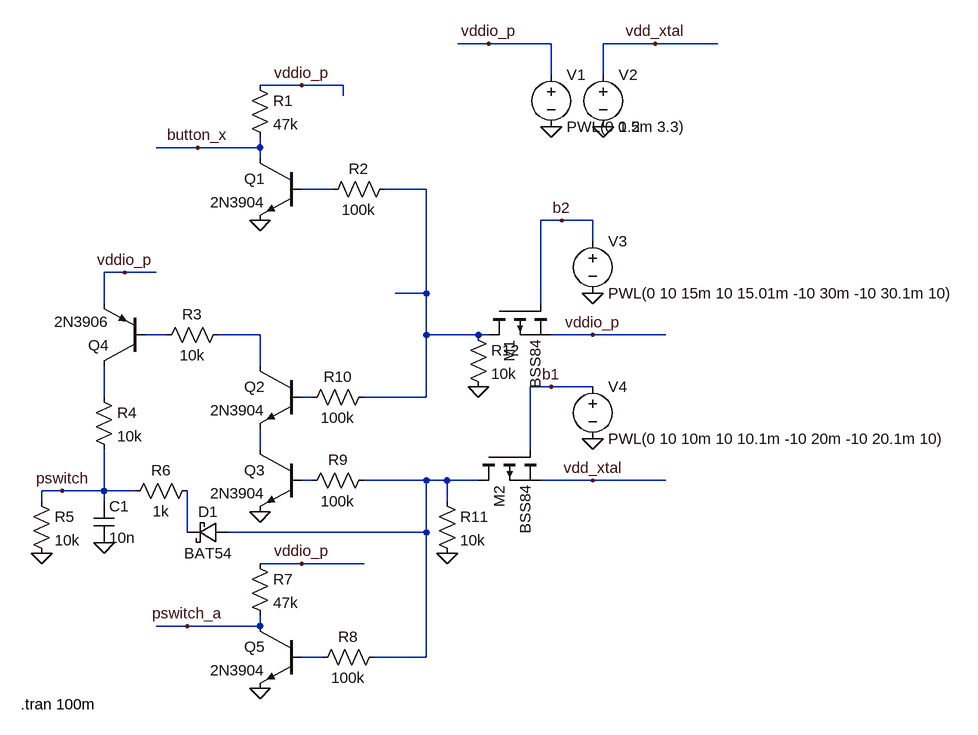
[diagram p0: schematic power switch and recovery mode pswitch.asc]
power switch and recovery mode pswitch.asc, the LTspice schematic file:
Version 4
SHEET 1 1348 984
WIRE 560 -48 512 -48
WIRE 656 -48 560 -48
WIRE 816 -48 736 -48
WIRE 912 -48 816 -48
WIRE 656 0 656 -48
WIRE 736 0 736 -48
WIRE 272 16 208 16
WIRE 336 16 272 16
WIRE 336 32 336 16
WIRE 112 112 48 112
WIRE 208 112 208 96
WIRE 208 112 112 112
WIRE 208 128 208 112
WIRE 320 176 272 176
WIRE 464 176 400 176
WIRE 672 224 640 224
WIRE 720 224 672 224
WIRE 720 256 720 224
WIRE 0 304 -32 304
WIRE 48 304 0 304
WIRE 464 336 464 176
WIRE 464 336 416 336
WIRE -32 352 -32 304
WIRE 640 352 640 224
WIRE 64 400 32 400
WIRE 208 400 144 400
WIRE 464 400 464 336
WIRE 544 400 464 400
WIRE 560 400 544 400
WIRE 720 400 656 400
WIRE 832 400 720 400
WIRE 208 448 208 400
WIRE 656 480 624 480
WIRE 720 480 656 480
WIRE -32 496 -32 448
WIRE 288 496 272 496
WIRE 464 496 464 400
WIRE 464 496 368 496
WIRE 208 576 208 544
WIRE 624 576 624 480
WIRE 288 624 272 624
WIRE 464 624 368 624
WIRE 496 624 464 624
WIRE 544 624 496 624
WIRE 720 624 640 624
WIRE 832 624 720 624
WIRE -96 640 -128 640
WIRE -32 640 -32 576
WIRE -32 640 -96 640
WIRE 16 640 -32 640
WIRE -128 656 -128 640
WIRE -32 656 -32 640
WIRE 496 656 496 624
WIRE 96 704 96 640
WIRE 464 704 464 624
WIRE 464 704 160 704
WIRE 272 752 208 752
WIRE 368 752 272 752
WIRE 96 848 48 848
WIRE 208 848 208 832
WIRE 208 848 96 848
WIRE 304 896 272 896
WIRE 464 896 464 704
WIRE 464 896 384 896
FLAG 208 672 0
FLAG 208 944 0
FLAG -32 720 0
FLAG -128 736 0
FLAG 208 224 0
FLAG -96 640 pswitch
FLAG 272 752 vddio_p
FLAG 96 848 pswitch_a
FLAG 272 16 vddio_p
FLAG 112 112 button_x
FLAG 0 304 vddio_p
FLAG 720 624 vdd_xtal
FLAG 720 400 vddio_p
FLAG 656 80 0
FLAG 736 80 0
FLAG 560 -48 vddio_p
FLAG 816 -48 vdd_xtal
FLAG 720 336 0
FLAG 720 560 0
FLAG 656 480 b1
FLAG 672 224 b2
FLAG 496 736 0
FLAG 544 480 0
SYMBOL res 192 0 R0
SYMATTR InstName R1
SYMATTR Value 47k
SYMBOL npn 272 128 M0
SYMATTR InstName Q1
SYMATTR Value 2N3904
SYMBOL res 416 160 R90
WINDOW 0 0 56 VBottom 0
WINDOW 3 32 56 VTop 0
SYMATTR InstName R2
SYMATTR Value 100k
SYMBOL npn 272 448 M0
SYMATTR InstName Q2
SYMATTR Value 2N3904
SYMBOL npn 272 576 M0
SYMATTR InstName Q3
SYMATTR Value 2N3904
SYMBOL pnp 32 448 R180
SYMATTR InstName Q4
SYMATTR Value 2N3906
SYMBOL res 160 384 R90
WINDOW 0 0 56 VBottom 0
WINDOW 3 32 56 VTop 0
SYMATTR InstName R3
SYMATTR Value 10k
SYMBOL res -48 480 R0
SYMATTR InstName R4
SYMATTR Value 10k
SYMBOL cap -48 656 R0
SYMATTR InstName C1
SYMATTR Value 10n
SYMBOL res -144 640 R0
SYMATTR InstName R5
SYMATTR Value 10k
SYMBOL res 112 624 R90
WINDOW 0 0 56 VBottom 0
WINDOW 3 32 56 VTop 0
SYMATTR InstName R6
SYMATTR Value 1k
SYMBOL npn 272 848 M0
SYMATTR InstName Q5
SYMATTR Value 2N3904
SYMBOL res 192 736 R0
SYMATTR InstName R7
SYMATTR Value 47k
SYMBOL res 400 880 R90
WINDOW 0 0 56 VBottom 0
WINDOW 3 32 56 VTop 0
SYMATTR InstName R8
SYMATTR Value 100k
SYMBOL res 384 608 R90
WINDOW 0 0 56 VBottom 0
WINDOW 3 32 56 VTop 0
SYMATTR InstName R9
SYMATTR Value 100k
SYMBOL res 384 480 R90
WINDOW 0 0 56 VBottom 0
WINDOW 3 32 56 VTop 0
SYMATTR InstName R10
SYMATTR Value 100k
SYMBOL pmos 560 352 M90
SYMATTR InstName M1
SYMATTR Value BSS84
SYMBOL pmos 544 576 M90
SYMATTR InstName M2
SYMATTR Value BSS84
SYMBOL voltage 656 -16 R0
WINDOW 123 0 0 Left 0
WINDOW 39 0 0 Left 0
SYMATTR InstName V1
SYMATTR Value PWL(0 0 5m 3.3)
SYMBOL voltage 736 -16 R0
WINDOW 123 0 0 Left 0
WINDOW 39 0 0 Left 0
SYMATTR InstName V2
SYMATTR Value 1.2
SYMBOL voltage 720 240 R0
WINDOW 123 0 0 Left 0
WINDOW 39 0 0 Left 0
SYMATTR InstName V3
SYMATTR Value PWL(0 10 15m 10 15.01m -10 30m -10 30.1m 10)
SYMBOL voltage 720 464 R0
WINDOW 123 0 0 Left 0
WINDOW 39 0 0 Left 0
SYMATTR InstName V4
SYMATTR Value PWL(0 10 10m 10 10.1m -10 20m -10 20.1m 10)
SYMBOL schottky 160 688 R90
WINDOW 0 0 32 VBottom 0
WINDOW 3 32 32 VTop 0
SYMATTR InstName D1
SYMATTR Value BAT54
SYMATTR Description Diode
SYMATTR Type diode
SYMBOL res 480 640 R0
SYMATTR InstName R11
SYMATTR Value 10k
SYMBOL res 528 384 R0
SYMATTR InstName R12
SYMATTR Value 10k
TEXT -160 968 Left 0 !.tran 100m

The netlist it stands for:
* power switch and recovery mode pswitch.asc
R1 vddio_p button_x 47k
Q1 button_x N001 0 0 2N3904
R2 N002 N001 100k
Q2 N004 N006 N007 0 2N3904
Q3 N007 N008 0 0 2N3904
Q4 N005 N003 vddio_p 0 2N3906
R3 N004 N003 10k
R4 N005 pswitch 10k
C1 pswitch 0 10n
R5 pswitch 0 10k
R6 N010 pswitch 1k
Q5 pswitch_a N011 0 0 2N3904
R7 vddio_p pswitch_a 47k
R8 N009 N011 100k
R9 N009 N008 100k
R10 N002 N006 100k
M1 N002 b2 vddio_p vddio_p BSS84
M2 N009 b1 vdd_xtal vdd_xtal BSS84
V1 vddio_p 0 PWL(0 0 5m 3.3)
V2 vdd_xtal 0 1.2
V3 b2 0 PWL(0 10 15m 10 15.01m -10 30m -10 30.1m 10)
V4 b1 0 PWL(0 10 10m 10 10.1m -10 20m -10 20.1m 10)
D1 N009 N010 BAT54
R11 N009 0 10k
R12 N002 0 10k
.model D D
.lib standard.dio
.model NPN NPN
.model PNP PNP
.lib standard.bjt
.model NMOS NMOS
.model PMOS PMOS
.lib standard.mos
.tran 100m
.backanno
.end

* Results of the author's LTspice run, read from the files saved beside the schematic
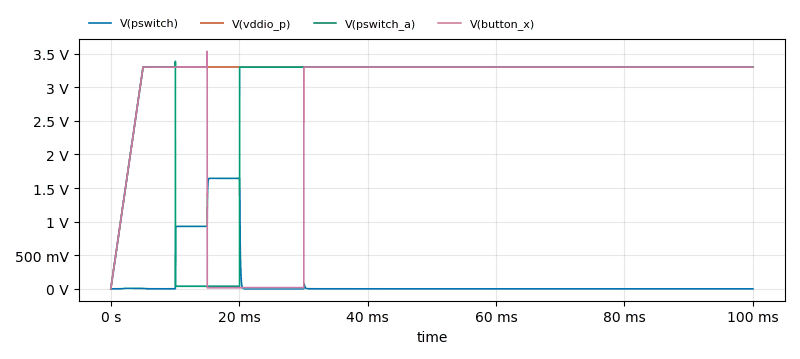
[diagram p1: Transient Analysis of power switch and recovery mode pswitch.asc, plotted from the saved traces]
* Transient Analysis, 1 run:
*   V(pswitch): min -55.46 µV, max 1.645 V, average 130.8 mV, rms 423.8 mV, last 23.12 µV
*   V(vddio_p): min 0 V, max 3.3 V, average 3.217 V, rms 3.245 V, last 3.3 V
*   V(pswitch_a): min 0 V, max 3.386 V, average 2.892 V, rms 3.073 V, last 3.3 V
*   V(button_x): min 0 V, max 3.536 V, average 2.723 V, rms 2.982 V, last 3.3 V